# Altium schematic sheet alpakka.schdoc
size 420 x 297 mm; Symbol: Sheet-Symbol_A3; Border: 1; Title Block Position: 3; Width: 1655; Height: 1170; Region Start: 1; X Region Count: 6; Y Region Count: 4; Blade Width: 10; Title Block: 1; @Board Name: alpakka_1; @Create Time: 09:50:37; @Update Time: 01:17:22; Company: 嘉立创EDA; Version: V1.0; Page Size: A3; @Project Name: alpakka_qk; @Page Count: 1; @Update Date: 2025-06-17; @Create Date: 2025-06-03; @Schematic Name: alpakka_1; @Page No: 1; @Page Name: alpakka; Device: Sheet-Symbol_A3
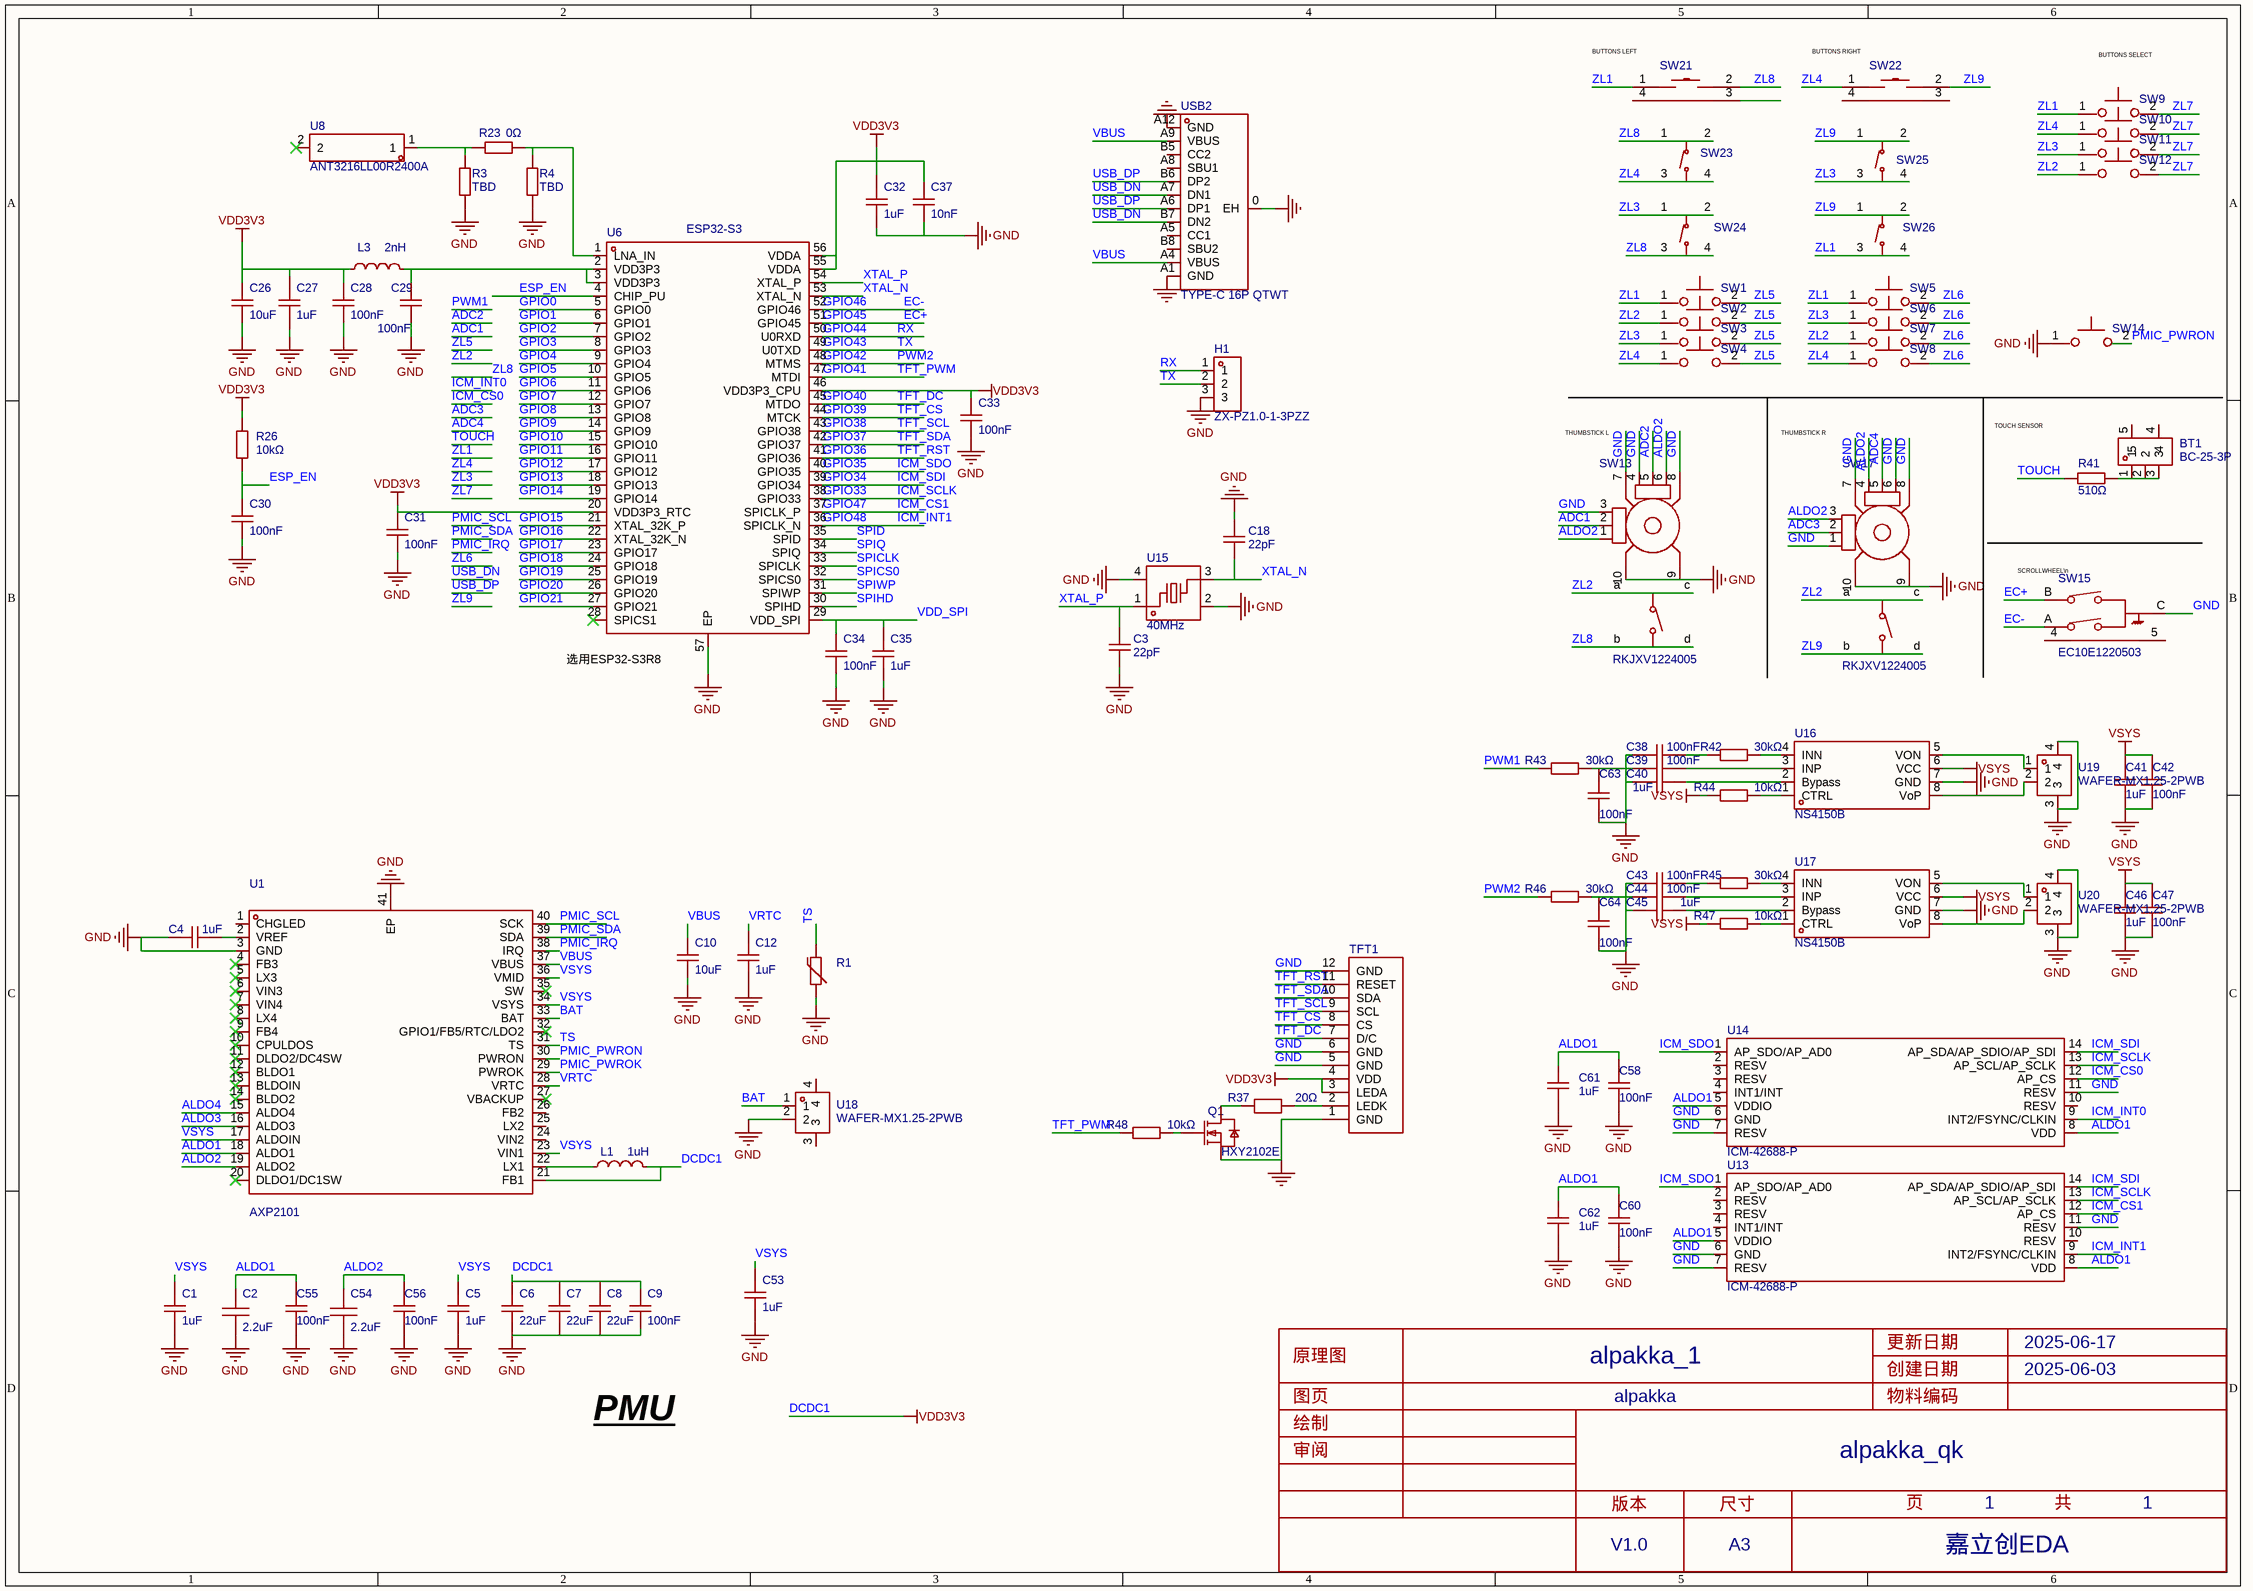
[diagram p0: alpakka.schdoc]

## Parts
BT1  BC-25-3P  [CONN-SMD_BC-25-3P]
C1  1uF  [C0402]
C2  value 2.2uF  [C0402]
C3  22pF  [C0402]
C4  1uF  [C0402]
C5  1uF  [C0402]
C6  22uF  [C0603]
C7  22uF  [C0603]
C8  22uF  [C0603]
C9  100nF  [C0402]
C10  10uF  [C0402]
C12  1uF  [C0402]
C18  22pF  [C0402]
C26  10uF  [C0402]
C27  1uF  [C0402]
C28  100nF  [C0402]
C29  100nF  [C0402]
C30  100nF  [C0402]
C31  100nF  [C0402]
C32  1uF  [C0402]
C33  100nF  [C0402]
C34  100nF  [C0402]
C35  1uF  [C0402]
C37  10nF  [C0402]
C38  100nF  [C0402]
C39  100nF  [C0402]
C40  1uF  [C0402]
C41  1uF  [C0402]
C42  100nF  [C0402]
C43  100nF  [C0402]
C44  100nF  [C0402]
C45  1uF  [C0402]
C46  1uF  [C0402]
C47  100nF  [C0402]
C53  1uF  [C0402]
C54  value 2.2uF  [C0402]
C55  100nF  [C0402]
C56  100nF  [C0402]
C58  100nF  [C0402]
C60  100nF  [C0402]
C61  1uF  [C0402]
C62  1uF  [C0402]
C63  100nF  [C0402]
C64  100nF  [C0402]
H1  ZX-PZ1.0-1-3PZZ  [HDR-TH_3P-P1.00-V-M-3]
L1  1uH  [IND-SMD_L2.5-W2.0_WPN252012H]
L3  2nH  [L0402]
Q1  HXY2102EI  [SOT-323-3_L2.1-W1.3-P1.30-LS2.3-BR]
R1  NCP18XH103F03RB  [R0603]  (value not drawn)
R3  TBD  [R0402]
R4  TBD  [R0402]
R23  0Ω  [R0402]
R26  10kΩ  [R0402]
R37  20Ω  [R0402]
R41  510Ω  [R0402]
R42  30kΩ  [R0402]
R43  30kΩ  [R0402]
R44  value 10kΩ  [R0402]  (hidden comment: 0402WGF1002TCE)
R45  30kΩ  [R0402]
R46  30kΩ  [R0402]
R47  value 10kΩ  [R0402]  (hidden comment: 0402WGF1002TCE)
R48  value 10kΩ  [R0402]  (hidden comment: 0402WGF1002TCE)
SW1  SKPMAME010  [KEY-SMD_2P-L6.0-W6.0-P6.00]  (value not drawn)
SW2  SKPMAME010  [KEY-SMD_2P-L6.0-W6.0-P6.00]  (value not drawn)
SW3  SKPMAME010  [KEY-SMD_2P-L6.0-W6.0-P6.00]  (value not drawn)
SW4  SKPMAME010  [KEY-SMD_2P-L6.0-W6.0-P6.00]  (value not drawn)
SW5  SKPMAME010  [KEY-SMD_2P-L6.0-W6.0-P6.00]  (value not drawn)
SW6  SKPMAME010  [KEY-SMD_2P-L6.0-W6.0-P6.00]  (value not drawn)
SW7  SKPMAME010  [KEY-SMD_2P-L6.0-W6.0-P6.00]  (value not drawn)
SW8  SKPMAME010  [KEY-SMD_2P-L6.0-W6.0-P6.00]  (value not drawn)
SW9  SKPMAME010  [KEY-SMD_2P-L6.0-W6.0-P6.00]  (value not drawn)
SW10  SKPMAME010  [KEY-SMD_2P-L6.0-W6.0-P6.00]  (value not drawn)
SW11  SKPMAME010  [KEY-SMD_2P-L6.0-W6.0-P6.00]  (value not drawn)
SW12  SKPMAME010  [KEY-SMD_2P-L6.0-W6.0-P6.00]  (value not drawn)
SW13  RKJXV1224005  [SW-TH_RKJXV1224005]
SW14  SKPMAME010  [KEY-SMD_2P-L6.0-W6.0-P6.00]  (value not drawn)
SW15  EC10E1220503  [SW-TH_EC10EXXXXXXX]
SW17  RKJXV1224005  [SW-TH_RKJXV1224005]
SW21  SKHHLNA010  [KEY-TH_SKHHLNA010]  (value not drawn)
SW22  SKHHLNA010  [KEY-TH_SKHHLNA010]  (value not drawn)
SW23  TS-1187A-B-A-B  [SW-SMD_4P-L5.1-W5.1-P3.70-LS6.5-TL_H1.5]  (value not drawn)
SW24  TS-1187A-B-A-B  [SW-SMD_4P-L5.1-W5.1-P3.70-LS6.5-TL_H1.5]  (value not drawn)
SW25  TS-1187A-B-A-B  [SW-SMD_4P-L5.1-W5.1-P3.70-LS6.5-TL_H1.5]  (value not drawn)
SW26  TS-1187A-B-A-B  [SW-SMD_4P-L5.1-W5.1-P3.70-LS6.5-TL_H1.5]  (value not drawn)
TFT1  tft  [0.71圆tft]  (value not drawn)
U1  (no value)  [QFN-40_L5.0-W5.0-P0.40-TL-EP3.4]
U6  ESP32-S3  [QFN-56_L7.0-W7.0-P0.40-TL-EP4.0]
U8  ANT3216LL00R2400A  [ANT-SMD_L3.2-W1.6]
U13  ICM-42688-P  [LGA-14_L3.0-W2.5-P0.50-TL]
U14  ICM-42688-P  [LGA-14_L3.0-W2.5-P0.50-TL]
U15  40MHz  [CRYSTAL-SMD_4P-L2.5-W2.0-BL]
U16  NS4150B  [MSOP-8_L3.0-W3.0-P0.65-LS5.0-BL]
U17  NS4150B  [MSOP-8_L3.0-W3.0-P0.65-LS5.0-BL]
U18  WAFER-MX1.25-2PWB  [CONN-SMD_2P-P1.25_XUNPU_WAFER-MX1.25-2PWB]
U19  WAFER-MX1.25-2PWB  [CONN-SMD_2P-P1.25_XUNPU_WAFER-MX1.25-2PWB]
U20  WAFER-MX1.25-2PWB  [CONN-SMD_2P-P1.25_XUNPU_WAFER-MX1.25-2PWB]
USB2  TYPE-C 16P QTWT  [USB-TYPE-C-SMD_TYPE-C-16P-QTWT]

## Nets
DCDC1: C6.2 C7.2 C8.2 C9.2 C26.2 C27.2 C28.2 C31.2 C32.2 C33.2 C37.2 L1.2 L3.1 R26.2 TFT1.3(LEDA) TFT1.4(VDD) U1.21(FB1) U6.20(VDD3P3_RTC) U6.46(VDD3P3_CPU) U6.55(VDDA) U6.56(VDDA)  [also labelled VDD3V3]
GND: C1.1 C2.1 C3.1 C4.1 C5.1 C6.1 C7.1 C8.1 C9.1 C10.1 C12.1 C18.2 C26.1 C27.1 C28.1 C29.1 C30.1 C31.1 C32.1 C33.1 C34.1 C35.1 C37.1 C38.1 C40.2 C41.1 C42.1 C43.1 C45.2 C46.1 C47.1 C53.1 C54.1 C55.1 C56.1 C58.1 C60.1 C61.1 C62.1 C63.1 C64.1 H1.3 Q1.2(S) R1.2 R3.1 R4.1 SW13.3(A) SW13.4(A) SW13.7(GND) SW13.8(GND) SW13.9(GND) SW13.10(GND) SW14.1 SW15.C SW17.1(B) SW17.6(B) SW17.7(GND) SW17.8(GND) SW17.9(GND) SW17.10(GND) TFT1.1(GND) TFT1.5(GND) TFT1.6(GND) TFT1.12(GND) U1.3(GND) U1.41(EP) U6.57(EP) U13.6(GND) U13.7(RESV) U13.11(RESV) U14.6(GND) U14.7(RESV) U14.11(RESV) U15.2(GND) U15.4(GND) U16.7(GND) U17.7(GND) U18.2 U19.3 U19.4 U20.3 U20.4 USB2.0(EH) USB2.A1(GND) USB2.A12(GND)
VSYS: C1.2 C5.2 C41.2 C42.2 C46.2 C47.2 C53.2 R44.1 R47.1 U1.17(ALDOIN) U1.23(VIN1) U1.34(VSYS) U1.36(VMID) U16.6(VCC) U17.6(VCC)
ADC1: SW13.2(DTA)
ADC2: SW13.5(DTA)
ADC3: SW17.2(DTA)
ADC4: SW17.5(DTA)
ALDO1: C2.2 C55.2 C58.2 C60.2 C61.2 C62.2 U1.18(ALDO1) U13.5(VDDIO) U13.8(VDD) U14.5(VDDIO) U14.8(VDD)
ALDO2: C54.2 C56.2 SW13.1(B) SW13.6(B) SW17.3(A) SW17.4(A) U1.19(ALDO2)
ALDO3: U1.16(ALDO3)
ALDO4: U1.15(ALDO4)
BAT: U1.33(BAT) U18.1
EC+: SW15.B U6.51(GPIO45)  [also labelled GPIO45]
EC-: SW15.A U6.52(GPIO46)  [also labelled GPIO46]
ESP_EN: C30.2 R26.1 U6.4(CHIP_PU)
GPIO0: U6.5(GPIO0)
GPIO1: U6.6(GPIO1)
GPIO2: U6.7(GPIO2)
GPIO3: U6.8(GPIO3)
GPIO4: U6.9(GPIO4)
GPIO5: U6.10(GPIO5)
GPIO6: U6.11(GPIO6)
GPIO7: U6.12(GPIO7)
GPIO8: U6.13(GPIO8)
GPIO9: U6.14(GPIO9)
GPIO10: U6.15(GPIO10)
GPIO11: U6.16(GPIO11)
GPIO12: U6.17(GPIO12)
GPIO13: U6.18(GPIO13)
GPIO14: U6.19(GPIO14)
GPIO15: U6.21(XTAL_32K_P)
GPIO16: U6.22(XTAL_32K_N)
GPIO17: U6.23(GPIO17)
GPIO18: U6.24(GPIO18)
GPIO19: U6.25(GPIO19)
GPIO20: U6.26(GPIO20)
GPIO21: U6.27(GPIO21)
GPIO33: U6.38(GPIO33) U13.13(AP_SCL/AP_SCLK) U14.13(AP_SCL/AP_SCLK)  [also labelled ICM_SCLK]
GPIO34: U6.39(GPIO34) U13.14(AP_SDA/AP_SDIO/AP_SDI) U14.14(AP_SDA/AP_SDIO/AP_SDI)  [also labelled ICM_SDI]
GPIO35: U6.40(GPIO35) U13.1(AP_SDO/AP_AD0) U14.1(AP_SDO/AP_AD0)  [also labelled ICM_SDO]
GPIO36: TFT1.11(RESET) U6.41(GPIO36)  [also labelled TFT_RST]
GPIO37: TFT1.10(SDA) U6.42(GPIO37)  [also labelled TFT_SDA]
GPIO38: TFT1.9(SCL) U6.43(GPIO38)  [also labelled TFT_SCL]
GPIO39: TFT1.8(CS) U6.44(MTCK)  [also labelled TFT_CS]
GPIO40: TFT1.7(D/C) U6.45(MTDO)  [also labelled TFT_DC]
GPIO41: R48.1 U6.47(MTDI)  [also labelled TFT_PWM]
GPIO42: R46.1 U6.48(MTMS)  [also labelled PWM2]
GPIO43: H1.2 U6.49(U0TXD)  [also labelled TX]
GPIO44: H1.1 U6.50(U0RXD)  [also labelled RX]
GPIO47: U6.37(SPICLK_P) U13.12(AP_CS)  [also labelled ICM_CS1]
GPIO48: U6.36(SPICLK_N) U13.9(INT2/FSYNC/CLKIN)  [also labelled ICM_INT1]
ICM_CS0: U14.12(AP_CS)
ICM_INT0: U14.9(INT2/FSYNC/CLKIN)
PMIC_IRQ: U1.38(IRQ)
PMIC_PWROK: U1.29(PWROK)
PMIC_PWRON: SW14.2 U1.30(PWRON)
PMIC_SCL: U1.40(SCK)
PMIC_SDA: U1.39(SDA)
PWM1: R43.1
SPICLK: U6.33(SPICLK)
SPICS0: U6.32(SPICS0)
SPID: U6.35(SPID)
SPIHD: U6.30(SPIHD)
SPIQ: U6.34(SPIQ)
SPIWP: U6.31(SPIWP)
TOUCH: R41.2
TS: R1.1 U1.31(TS)
USB_DN: USB2.A7(DN1) USB2.B7(DN2)
USB_DP: USB2.A6(DP1) USB2.B6(DP2)
VBUS: C10.2 U1.37(VBUS) USB2.A4(VBUS) USB2.A9(VBUS)
VDD_SPI: C34.2 C35.2 U6.29(VDD_SPI)
VRTC: C12.2 U1.28(VRTC)
XTAL_N: C18.1 U6.53(XTAL_N) U15.3
XTAL_P: C3.2 U6.54(XTAL_P) U15.1
ZL1: SW1.1 SW5.1 SW9.1 SW21.1 SW26.3(C) SW26.4(D)
ZL2: SW2.1 SW7.1 SW12.1 SW13.a SW13.c SW17.a SW17.c
ZL3: SW3.1 SW6.1 SW11.1 SW24.1(A) SW24.2(B) SW25.3(C) SW25.4(D)
ZL4: SW4.1 SW8.1 SW10.1 SW22.1 SW23.3(C) SW23.4(D)
ZL5: SW1.2 SW2.2 SW3.2 SW4.2
ZL6: SW5.2 SW6.2 SW7.2 SW8.2
ZL7: SW9.2 SW10.2 SW11.2 SW12.2
ZL8: SW13.b SW13.d SW21.2 SW23.1(A) SW23.2(B) SW24.3(C) SW24.4(D)
ZL9: SW17.b SW17.d SW22.2 SW25.1(A) SW25.2(B) SW26.1(A) SW26.2(B)
NetBT1_1: BT1.1 BT1.2 BT1.3 R41.1
NetC4_2: C4.2 U1.2(VREF)
NetC29_2: C29.2 L3.2 U6.2(VDD3P3) U6.3(VDD3P3)
NetC38_2: C38.2 R42.1
NetC39_1: C39.1 C63.2 R43.2
NetC39_2: C39.2 U16.3(INP)
NetC40_1: C40.1 U16.2(Bypass)
NetC43_2: C43.2 R45.1
NetC44_1: C44.1 C64.2 R46.2
NetC44_2: C44.2 U17.3(INP)
NetC45_1: C45.1 U17.2(Bypass)
NetL1_1: L1.1 U1.22(LX1)
NetQ1_1: Q1.1(G) R48.2
NetQ1_3: Q1.3(D) R37.1
NetR3_2: R3.2 R23.1 U8.1
NetR4_2: R4.2 R23.2 U6.1(LNA_IN)
NetR37_2: R37.2 TFT1.2(LEDK)
NetR42_2: R42.2 U16.4(INN)
NetR44_2: R44.2 U16.1(CTRL)
NetR45_2: R45.2 U17.4(INN)
NetR47_2: R47.2 U17.1(CTRL)
NetU16_5: U16.5(VON) U19.1
NetU16_8: U16.8(VoP) U19.2
NetU17_5: U17.5(VON) U20.1
NetU17_8: U17.8(VoP) U20.2

Not connected (* = marked no-connect by the designer): BT1 4 5; SW15 4 5; SW21 3 4; SW22 3 4; U1 1(CHGLED) 4(FB3)* 5(LX3)* 6(VIN3)* 7(VIN4)* 8(LX4)* 9(FB4)* 10(CPULDOS)* 11(DLDO2/DC4SW)* 12(BLDO1)* 13(BLDOIN)* 14(BLDO2)* 20(DLDO1/DC1SW)* 24(VIN2) 25(LX2) 26(FB2) 27(VBACKUP)* 32(GPIO1/FB5/RTC/LDO2)* 35(SW)*; U6 28(SPICS1)*; U8 2*; U13 2(RESV) 3(RESV) 4(INT1/INT) 10(RESV); U14 2(RESV) 3(RESV) 4(INT1/INT) 10(RESV); U18 3 4; USB2 A5(CC1) A8(SBU1) B5(CC2) B8(SBU2)

## Notes on the sheet
- (near SW21) BUTTONS LEFT
- (near SW22) BUTTONS RIGHT
- BUTTONS SELECT
- (near SW13) THUMBSTICK L
- THUMBSTICK R
- TOUCH SENSOR
- (near SW15) SCROLLWHEEL\n
- (near U6) 选用ESP32-S3R8
- PMU
- 更新日期
- 2025-06-17
- 原理图
- 图页
- alpakka_1
- alpakka
- 创建日期
- 物料编码
- 2025-06-03
- 审阅
- 绘制
- alpakka_qk
- 版本
- V1.0
- 尺寸
- A3
- 页
- 1
- 嘉立创EDA
- 共

## Library data of the parts
BT1 = BC-25-3P: Manufacturer: 韩国韩荣; AddInBom: yes; ModelId: 0ec633dd042e4116a02132133930fbed; ModelTransform: 196.85,295.275,0,0,0,0,0,0.005,0; Symbol: BC-25-3P; Device: BC-25-3P; LCSC Part Name: BC-25-3P; SupplierPart: C707322; ManufacturerPart: BC-25-3P; Supplier Footprint: SMD; JLCPCB Part Class: 扩展库; Datasheet: https://atta.szlcsc.com/upload/public/pdf/source/20200721/C707322_5998A93FC9E23FFA5808166050F8C0CF.pdf; Supplier: LCSC; ConvertToPcb: yes; FootprintName: CONN-SMD_BC-25-3P; ModelName: CONN-SMD_BC-25-3P
C1 C4 C5 C12 C27 C32 C35 C40 C41 C45 C46 C53 C61 C62 = CL05A105KA5NQNC: 容值:1uF;精度:±10%;额定电压:25V;材质(温度系数):X5R;; Manufacturer: SAMSUNG(三星); AddInBom: yes; ModelId: 36a51122f27c49738f86b3bfa98863e0; ModelName: C0402_L1.0-W0.5-H0.5; ModelTransform: 39.37,19.685,0,0,0,0,0,0,0; Tolerance: ±10%; Voltage Rated: 25V; Temperature Coefficient: X5R; Symbol: CL05A105KA5NQNC; Value: 1uF; Device: CL05A105KA5NQNC; LCSC Part Name: 1uF ±10% 25V; SupplierPart: C52923; ManufacturerPart: CL05A105KA5NQNC; Supplier Footprint: 0402; JLCPCB Part Class: 基础库; Datasheet: https://atta.szlcsc.com/upload/public/pdf/source/20160103/1457707735223.pdf; Supplier: LCSC; ConvertToPcb: yes; FootprintName: C0402
C2 C54 = CL05A225MQ5NSNC: 容值:2.2uF;精度:±20%;额定电压:6.3V;温度系数:X5R;; Manufacturer: SAMSUNG(三星); AddInBom: yes; ModelId: 36a51122f27c49738f86b3bfa98863e0; ModelName: C0402_L1.0-W0.5-H0.5; ModelTransform: 39.37,19.685,0,0,0,0,0,0,0; Tolerance: ±20%; Voltage Rated: 6.3V; Temperature Coefficient: X5R; Device: CL05A225MQ5NSNC; Symbol: CL05A225MQ5NSNC; LCSC Part Name: 2.2uF ±20% 6.3V; SupplierPart: C12530; ManufacturerPart: CL05A225MQ5NSNC; Supplier Footprint: 0402; JLCPCB Part Class: Basic Part; Datasheet: https://atta.szlcsc.com/upload/public/pdf/source/20160103/1457707666860.pdf; Supplier: LCSC; ConvertToPcb: yes; FootprintName: C0402
C3 C18 = 0402CG220J500NT: 容值:22pF;精度:±5%;额定电压:50V;温度系数:C0G;; Manufacturer: FH(风华); AddInBom: yes; ModelId: 36a51122f27c49738f86b3bfa98863e0; ModelName: C0402_L1.0-W0.5-H0.5; ModelTransform: 39.37,19.685,0,0,0,0,0,0,0; Tolerance: ±5%; Voltage Rated: 50V; Temperature Coefficient: C0G; Value: 22pF; Device: 0402CG220J500NT; Symbol: 0402CG220J500NT; LCSC Part Name: 22pF ±5% 50V; SupplierPart: C1555; ManufacturerPart: 0402CG220J500NT; Supplier Footprint: 0402; JLCPCB Part Class: 基础库; Datasheet: https://atta.szlcsc.com/upload/public/pdf/source/20170923/C1555_1506149269156988362.pdf; Supplier: LCSC; ConvertToPcb: yes; FootprintName: C0402
C6-C8 = CL10A226MQ8NRNC: 容值:22uF;精度:±20%;额定电压:6.3V;材质(温度系数):X5R;; Manufacturer: SAMSUNG(三星); AddInBom: yes; ModelId: ac125912035d415993ca9572d50418b1; ModelName: C0603_L1.6-W0.8-H0.8; ModelTransform: 62.992,31.496,0,0,0,0,0,0,0; Tolerance: ±20%; Voltage Rated: 6.3V; Temperature Coefficient: X5R; Value: 22uF; Device: CL10A226MQ8NRNC; Symbol: CL10A226MQ8NRNC; LCSC Part Name: 22uF ±20% 6.3V; SupplierPart: C59461; ManufacturerPart: CL10A226MQ8NRNC; Supplier Footprint: 0603; JLCPCB Part Class: 基础库; Datasheet: https://atta.szlcsc.com/upload/public/pdf/source/20160103/1457707740762.pdf; Supplier: LCSC; ConvertToPcb: yes; FootprintName: C0603
C9 C28-C31 C33 C34 = CL05B104KO5NNNC: 容值:100nF;精度:±10%;额定电压:16V;材质(温度系数):X7R;; Manufacturer: SAMSUNG(三星); AddInBom: yes; ModelId: 36a51122f27c49738f86b3bfa98863e0; ModelName: C0402_L1.0-W0.5-H0.5; ModelTransform: 39.37,19.685,0,0,0,0,0,0,0; Tolerance: ±10%; Voltage Rated: 16V; Temperature Coefficient: X7R; Value: 100nF; Device: CL05B104KO5NNNC; Symbol: CL05B104KO5NNNC; LCSC Part Name: 100nF ±10% 16V; SupplierPart: C1525; ManufacturerPart: CL05B104KO5NNNC; Supplier Footprint: 0402; JLCPCB Part Class: Basic Part; Datasheet: https://atta.szlcsc.com/upload/public/pdf/source/20160103/1457707674891.pdf; Supplier: LCSC; ConvertToPcb: yes; FootprintName: C0402
C10 C26 = CL05A106MQ5NUNC: 容值:10uF;精度:±20%;额定电压:6.3V;材质(温度系数):X5R;; Manufacturer: SAMSUNG(三星); AddInBom: yes; ModelId: 36a51122f27c49738f86b3bfa98863e0; ModelName: C0402_L1.0-W0.5-H0.5; ModelTransform: 39.37,19.685,0,0,0,0,0,0,0; Tolerance: ±20%; Voltage Rated: 6.3V; Temperature Coefficient: X5R; Value: 10uF; Device: CL05A106MQ5NUNC; Symbol: CL05A106MQ5NUNC; LCSC Part Name: 10uF ±20% 6.3V; SupplierPart: C15525; ManufacturerPart: CL05A106MQ5NUNC; Supplier Footprint: 0402; JLCPCB Part Class: 基础库; Datasheet: https://atta.szlcsc.com/upload/public/pdf/source/20220823/2B02EE04F8F211D38A52DCB16EB6BEBA.pdf; Supplier: LCSC; ConvertToPcb: yes; FootprintName: C0402
C37 = CL05B103KB5NNNC: 容值:10nF;精度:±10%;额定电压:50V;材质(温度系数):X7R;; Manufacturer: SAMSUNG(三星); AddInBom: yes; ModelId: 36a51122f27c49738f86b3bfa98863e0; ModelName: C0402_L1.0-W0.5-H0.5; ModelTransform: 39.37,19.685,0,0,0,0,0,0,0; Tolerance: ±10%; Voltage Rated: 50V; Temperature Coefficient: X7R; Value: 10nF; Device: CL05B103KB5NNNC; Symbol: CL05B103KB5NNNC; LCSC Part Name: 10nF ±10% 50V; SupplierPart: C15195; ManufacturerPart: CL05B103KB5NNNC; Supplier Footprint: 0402; JLCPCB Part Class: 基础库; Datasheet: https://atta.szlcsc.com/upload/public/pdf/source/20160103/1457707674468.pdf; Supplier: LCSC; ConvertToPcb: yes; FootprintName: C0402
C38 C39 C42-C44 C47 C55 C56 C58 C60 C63 C64 = CL05B104KB54PNC: 容值:100nF;精度:±10%;额定电压:50V;材质(温度系数):X7R;; Manufacturer: SAMSUNG(三星); AddInBom: yes; ModelId: 36a51122f27c49738f86b3bfa98863e0; ModelName: C0402_L1.0-W0.5-H0.5; ModelTransform: 39.37,19.685,0,0,0,0,0,0,0; Tolerance: ±10%; Voltage Rated: 50V; Temperature Coefficient: X7R; Symbol: CL05B104KB54PNC; Device: CL05B104KB54PNC; LCSC Part Name: 100nF ±10% 50V; SupplierPart: C307331; ManufacturerPart: CL05B104KB54PNC; Supplier Footprint: 0402; JLCPCB Part Class: 基础库; Datasheet: https://atta.szlcsc.com/upload/public/pdf/source/20160218/1457707763339.pdf; Supplier: LCSC; ConvertToPcb: yes; FootprintName: C0402; Value: 100nF
H1 = ZX-PZ1.0-1-3PZZ: 插针结构:1x3P;间距:1mm;行距:-;圆针/方针:方针;安装方式:直插;排数:单排;总PIN位数:3P;额定电流:750mA;配合针长度:2mm;塑高:1mm;端接针长度:2mm;触头材质:黄铜;触头镀层:金;工作温度:-40℃~+105℃;颜色:黑色;; Manufacturer: Megastar(兆星); AddInBom: yes; ModelId: 6f6203f6db8b4f489789f9ab3199bf84; ModelTransform: 118.5037,59.055,0,0,0,0,0,0,-78.74; Pin Structure: 1x3P; Pitch: 1mm; Circluar Pins/Square Pins: 方针; Current Rating: 750mA; Symbol: ZX-PZ1.0-1-3PZZ; Device: ZX-PZ1.0-1-3PZZ; LCSC Part Name: 1x3P 间距:1mm 方针 直插; SupplierPart: C37328853; ManufacturerPart: ZX-PZ1.0-1-3PZZ; Supplier Footprint: 插件,P=1mm; JLCPCB Part Class: 扩展库; Datasheet: https://atta.szlcsc.com/upload/public/pdf/source/20240812/85F48A99F7C6AED78605DAA33CDE8A90.pdf; Supplier: LCSC; ConvertToPcb: yes; FootprintName: HDR-TH_3P-P1.00-V-M-3; ModelName: HDR-TH_3P-P1.00-V-M-3; Row Spacing: -; Mounting Type: 直插; Number of Rows: 单排; Number of Pins: 3P; Length of Mating Pin: 2mm; Insulation Height: 1mm; Length of End Connection Pin: 2mm; Contact Material: 黄铜; Contact Plating: 金; Operating Temperature: -40℃~+105℃; Color: 黑色
L1 = WPN252012H1R0MT: 电感值:1uH;精度:±20%;额定电流:3A;直流电阻(DCR):54mΩ;; Manufacturer: Sunlord(顺络); AddInBom: yes; ModelId: 7ae8e774cfcf498ea5119a488d0de531; ModelName: IND-SMD_L2.5-W2.0-H1.2-252012; ModelTransform: 78.74,99.2124,0,90,0,0,0,0,0; Tolerance: ±20%; Rated Current: 3A; DC Resistance (DCR): 54mΩ; Value: 1uH; Device: WPN252012H1R0MT; Symbol: WPN252012H1R0MT; LCSC Part Name: 1uH ±20% 3A 54mΩ; SupplierPart: C98348; ManufacturerPart: WPN252012H1R0MT; Supplier Footprint: SMD; JLCPCB Part Class: 扩展库; Datasheet: https://atta.szlcsc.com/upload/public/pdf/source/20210916/5D33DED32780FEB7D0AA8BED8FC93477.pdf; Supplier: LCSC; ConvertToPcb: yes; FootprintName: IND-SMD_L2.5-W2.0_WPN252012H
L3 = LQG15HS2N0S02D: 电感值:2nH;精度:±0.3nH;额定电流:900mA;饱和电流(Isat):-;直流电阻(DCR):90mΩ;; Manufacturer: muRata(村田); AddInBom: yes; ModelId: d8d36575a3234d4790bfa765c88664a7; ModelName: L0402_L1.0-W0.5-H0.5_BEAD; ModelTransform: 39.37,19.685,0,0,0,0,0,0.0005,0; Tolerance: ±0.3nH; Rated Current: 900mA; DC Resistance (DCR): 90mΩ; Q @ Freq: 8@100MHz; Frequency - Self Resonant: 6GHz; Value: 2nH; Device: LQG15HS2N0S02D; Symbol: LQG15HS2N0S02D; LCSC Part Name: 2nH ±0.3nH 900mA 90mΩ; SupplierPart: C18216; ManufacturerPart: LQG15HS2N0S02D; Supplier Footprint: 0402; JLCPCB Part Class: 扩展库; Datasheet: https://atta.szlcsc.com/upload/public/pdf/source/20190514/C18216_4C6D770518CF7A3B206943E09D2940CE.pdf; Supplier: LCSC; ConvertToPcb: yes; FootprintName: L0402; Saturation Current (Isat): -; Ratings: -
Q1 = HXY2102EI: 类型:1个N沟道;漏源电压(Vdss):20V;连续漏极电流(Id):2A;导通电阻(RDS(on)):85mΩ@2.5V,0.3A;耗散功率(Pd):300mW;阈值电压(Vgs(th)):1V;; Manufacturer: HXY MOSFET(华轩阳电子); AddInBom: yes; ModelId: 81bbbbdf3145418d8c918b8f2fd0a837; ModelTransform: 90.551,78.74,0,0,0,0,0,0,0; Type: 1个N沟道; Drain to Source Voltage: 20V; Current - Continuous Drain(Id): 2A; Pd - Power Dissipation: 300mW; Gate Threshold Voltage (Vgs(th)@Id): 1V; Input Capacitance(Ciss@Vds): 300pF@10V; Reverse Transfer Capacitance (Crss@Vds): 80pF; Symbol: HXY2102EI; Device: HXY2102EI; LCSC Part Name: 1个N沟道 耐压:20V 电流:2A; SupplierPart: C5148642; ManufacturerPart: HXY2102EI; Supplier Footprint: SOT-323; JLCPCB Part Class: 扩展库; Datasheet: https://atta.szlcsc.com/upload/public/pdf/source/20220906/0D27EEFCD7B51BEC6BD7AC8F94EC5A10.pdf; Supplier: LCSC; ConvertToPcb: yes; FootprintName: SOT-323-3_L2.1-W1.3-P1.30-LS2.3-BR; ModelName: SOT-323-3_L2.1-W1.3-P1.30-LS2.3-BR; RDS(on): 85mΩ@2.5V,0.3A; Operating Temperature: -55℃~+150℃
R1 = NCP18XH103F03RB: 阻值(25℃):10kΩ;电阻精度:±1%;B值精度:±1%;B值(25℃/50℃):3380K;功率:100mW;最大稳态电流(25℃):310uA;B值(25℃/75℃):-;B值(25℃/85℃):3334K;B值(25℃/100℃):3455K;工作温度:-40℃~+125℃;; Manufacturer: muRata(村田); AddInBom: yes; ModelId: fc143cca1e79419f9cd78b61e9279f08; ModelTransform: 31.8897,63.7794,0,90,0,0,0,0,0; Resistance @ 25℃: 10kΩ; Resistance Tolerance: ±1%; B Constant (25℃/50℃): 3380K; Power: 100mW; Steady State Current (Max): 310uA; B Constant (25℃/85℃): 3334K; B Constant (25℃/100℃): 3455K; Device: NCP18XH103F03RB; Symbol: NCP18XH103F03RB; LCSC Part Name: 10kΩ 电阻精度:±1% 3380K; SupplierPart: C13564; ManufacturerPart: NCP18XH103F03RB; Supplier Footprint: 0603; JLCPCB Part Class: 扩展库; Datasheet: https://atta.szlcsc.com/upload/public/pdf/source/20130819/1457706638081.pdf; Supplier: LCSC; ConvertToPcb: yes; FootprintName: R0603; ModelName: R0603; B Constant Tolerance: ±1%; B Constant (25℃/75℃): -; Operating Temperature: -40℃~+125℃
R3 R4 = 0402WGF0000TCE: 电阻类型:厚膜电阻;阻值:0Ω;精度:±1%;功率:1/16W;温度系数:±800ppm/;最大工作电压:50V;工作温度范围:-55~+155;; Manufacturer: UNI-ROYAL(厚声); Check: false; AddInBom: yes; ModelId: 671aefced39d4c318694bba8bd8efd39; ModelName: R0402_L1.0-W0.5-H0.5; ModelTransform: 39.37,19.685,0,0,0,0,0,0.0005,0; Tolerance: ±1%; Power(Watts): 1/16W; Overload Voltage (Max): 50V; Value: TBD; Temperature Coefficient: ±800ppm/; Operating Temperature Range: -55~+155; Device: 0402WGF0000TCE; Symbol: 0402WGF0000TCE; LCSC Part Name: 0Ω ±1% 1/16W; SupplierPart: C17168; ManufacturerPart: 0402WGF0000TCE; Supplier Footprint: 0402; JLCPCB Part Class: 基础库; Datasheet: https://atta.szlcsc.com/upload/public/pdf/source/20200306/C422600_1E6D84923E4A46A82E41ADD87F860B5C.pdf; Supplier: LCSC; ConvertToPcb: yes; FootprintName: R0402; Type: 厚膜电阻
R23 = 0402WGF0000TCE: 电阻类型:厚膜电阻;阻值:0Ω;精度:±1%;功率:1/16W;温度系数:±800ppm/;最大工作电压:50V;工作温度范围:-55~+155;; Manufacturer: UNI-ROYAL(厚声); AddInBom: yes; ModelId: 671aefced39d4c318694bba8bd8efd39; ModelName: R0402_L1.0-W0.5-H0.5; ModelTransform: 39.37,19.685,0,0,0,0,0,0.0005,0; Tolerance: ±1%; Power(Watts): 1/16W; Overload Voltage (Max): 50V; Value: 0Ω; Temperature Coefficient: ±800ppm/; Operating Temperature Range: -55~+155; Device: 0402WGF0000TCE; Symbol: 0402WGF0000TCE; LCSC Part Name: 0Ω ±1% 1/16W; SupplierPart: C17168; ManufacturerPart: 0402WGF0000TCE; Supplier Footprint: 0402; JLCPCB Part Class: 基础库; Datasheet: https://atta.szlcsc.com/upload/public/pdf/source/20200306/C422600_1E6D84923E4A46A82E41ADD87F860B5C.pdf; Supplier: LCSC; ConvertToPcb: yes; FootprintName: R0402; Type: 厚膜电阻
R26 R44 R47 R48 = 0402WGF1002TCE: 电阻类型:厚膜电阻;阻值:10kΩ;精度:±1%;功率:62.5mW;; Manufacturer: UNI-ROYAL(厚声); AddInBom: yes; ModelId: 671aefced39d4c318694bba8bd8efd39; ModelName: R0402_L1.0-W0.5-H0.5; ModelTransform: 39.37,19.685,0,0,0,0,0,0.0005,0; Tolerance: ±1%; Power(Watts): 62.5mW; Temperature Coefficient: ±100ppm/℃; Overload Voltage (Max): 50V; Device: 0402WGF1002TCE; Symbol: 0402WGF1002TCE; LCSC Part Name: 10kΩ ±1% 62.5mW; SupplierPart: C25744; ManufacturerPart: 0402WGF1002TCE; Supplier Footprint: 0402; JLCPCB Part Class: 基础库; Datasheet: https://atta.szlcsc.com/upload/public/pdf/source/20200306/C422600_1E6D84923E4A46A82E41ADD87F860B5C.pdf; Supplier: LCSC; ConvertToPcb: yes; FootprintName: R0402; Type: 厚膜电阻; Operating Temperature Range: -55℃~+155℃
  R26: Value: 10kΩ
R37 = AF0402FR-0720RL: 电阻类型:厚膜电阻;阻值:20Ω;精度:±1%;功率:62.5mW;最大工作电压:50V;温度系数:±100ppm/℃;; Manufacturer: YAGEO(国巨); AddInBom: yes; ModelId: 98c88bc2b9094f218f3a3e30a7012738; ModelName: R0402_L1.0-W0.5-H0.4; ModelTransform: 39.37,19.685,0,0,0,0,0,0,0; Tolerance: ±1%; Power(Watts): 62.5mW; Overload Voltage (Max): 50V; Symbol: AF0402FR-0720RL; Device: AF0402FR-0720RL; LCSC Part Name: 厚膜电阻 20Ω ±1% 62.5mW; SupplierPart: C705025; ManufacturerPart: AF0402FR-0720RL; Supplier Footprint: 0402; JLCPCB Part Class: 扩展库; Datasheet: https://atta.szlcsc.com/upload/public/pdf/source/20200720/C705025_F8F68893B9797187D9694860BA30C4EB.pdf; Supplier: LCSC; ConvertToPcb: yes; FootprintName: R0402; Type: 厚膜电阻; Value: 20Ω; Temperature Coefficient: ±100ppm/℃; Operating Temperature Range: -55℃~+155℃
R41 = 0402WGF5100TCE: 电阻类型:厚膜电阻;阻值:510Ω;精度:±1%;功率:62.5mW;最大工作电压:50V;温度系数:±100ppm/℃;; Manufacturer: UNI-ROYAL(厚声); AddInBom: yes; ModelId: 98c88bc2b9094f218f3a3e30a7012738; ModelName: R0402_L1.0-W0.5-H0.4; ModelTransform: 39.37,19.685,0,0,0,0,0,0,0; Tolerance: ±1%; Power(Watts): 62.5mW; Overload Voltage (Max): 50V; Symbol: 0402WGF5100TCE; Device: 0402WGF5100TCE; LCSC Part Name: 510Ω ±1% 62.5mW 厚膜电阻; SupplierPart: C25123; ManufacturerPart: 0402WGF5100TCE; Supplier Footprint: 0402; JLCPCB Part Class: 基础库; Datasheet: https://atta.szlcsc.com/upload/public/pdf/source/20200306/C422600_1E6D84923E4A46A82E41ADD87F860B5C.pdf; Supplier: LCSC; ConvertToPcb: yes; FootprintName: R0402; Type: 厚膜电阻; Value: 510Ω; Temperature Coefficient: ±100ppm/℃; Operating Temperature Range: -55℃~+155℃
R42 R43 R45 R46 = 0402WGF3002TCE: 电阻类型:厚膜电阻;阻值:30kΩ;精度:±1%;功率:62.5mW;最大工作电压:50V;温度系数:±100ppm/℃;; Manufacturer: UNI-ROYAL(厚声); AddInBom: yes; ModelId: 98c88bc2b9094f218f3a3e30a7012738; ModelName: R0402_L1.0-W0.5-H0.4; ModelTransform: 39.37,19.685,0,0,0,0,0,0,0; Tolerance: ±1%; Power(Watts): 62.5mW; Overload Voltage (Max): 50V; Symbol: 0402WGF3002TCE; Device: 0402WGF3002TCE; LCSC Part Name: 30kΩ ±1% 62.5mW 厚膜电阻; SupplierPart: C25776; ManufacturerPart: 0402WGF3002TCE; Supplier Footprint: 0402; JLCPCB Part Class: 扩展库; Datasheet: https://atta.szlcsc.com/upload/public/pdf/source/20200306/C422600_1E6D84923E4A46A82E41ADD87F860B5C.pdf; Supplier: LCSC; ConvertToPcb: yes; FootprintName: R0402; Type: 厚膜电阻; Value: 30kΩ; Temperature Coefficient: ±100ppm/℃; Operating Temperature Range: -55℃~+155℃
SW1-SW12 SW14 = SKPMAME010: 电路结构:单刀单掷;按钮形状:圆形按钮;安装方式:立贴;开关长度:6mm;开关宽度:5.9mm;开关高度:5mm;触点电流:50mA;额定电压(DC):16V;带灯:-;机械寿命:-;; Manufacturer: ALPSALPINE(阿尔卑斯阿尔派); AddInBom: yes; ModelId: be0d10cf1ad744bda11cb4858781af3b; ModelName: KEY-SMD_2P-L6.0-W6.0-H5.0-P6.00; ModelTransform: 259.82917,236.22,0,0,0,0,0,0,0; Circuit: 单刀单掷; Actuator Style: 圆形按钮; Switch Length: 6mm; Switch Width: 5.9mm; Switch Height: 5mm; Contact Current: 50mA; Voltage Rating (DC): 16V; Symbol: SKPMAME010; Device: SKPMAME010; LCSC Part Name: 6*5.9*5mm 立贴 轻触开关; SupplierPart: C115348; ManufacturerPart: SKPMAME010; Supplier Footprint: SMD; JLCPCB Part Class: 扩展库; Datasheet: https://atta.szlcsc.com/upload/public/pdf/source/20170620/1497944811112.pdf; Supplier: LCSC; ConvertToPcb: yes; FootprintName: KEY-SMD_2P-L6.0-W6.0-P6.00; Mounting Style: 立贴; With Lamp: -; Mechanical Life: -
SW13 SW17 = RKJXV1224005: 操纵杆复位 中央按动开关 适用于航模玩具遥控器电位器、3D摇杆PS4手柄游戏机、无人机摇杆电位器、工业控制器; Manufacturer: ALPSALPINE(阿尔卑斯阿尔派); AddInBom: yes; ModelId: d71267aa208e4a128cc15a7eb8740b01; ModelTransform: 681.101,838.581,0,0,0,0,-5.905,-5.906,-86.614; Symbol: RKJXV1224005; Device: RKJXV1224005; LCSC Part Name: RKJXV1224005; SupplierPart: C146170; ManufacturerPart: RKJXV1224005; Supplier Footprint: 插件,13x13mm; JLCPCB Part Class: 扩展库; Datasheet: https://atta.szlcsc.com/upload/public/pdf/source/20180125/C146170_15168615510911301620.pdf; Supplier: LCSC; ConvertToPcb: yes; FootprintName: SW-TH_RKJXV1224005; ModelName: SW-TH_RKJXV1224005
SW15 = EC10E1220503: Manufacturer: ALPSALPINE(阿尔卑斯阿尔派); AddInBom: yes; ModelId: 0c229d12ce9545cfb4bea5dc3d5e3367; ModelName: SW-TH_EC10EXXXXXXX-L9.8-W6.1-H14.6-P2.5; ModelTransform: 434.91937,240.157,0,180,0,0,0,13.779,-137.795; Symbol: EC10E1220503; Device: EC10E1220503; LCSC Part Name: EC10E1220503; SupplierPart: C110291; ManufacturerPart: EC10E1220503; Supplier Footprint: 插件; JLCPCB Part Class: 扩展库; Datasheet: https://atta.szlcsc.com/upload/public/pdf/source/20170428/1493376811855.pdf; Supplier: LCSC; ConvertToPcb: yes; FootprintName: SW-TH_EC10EXXXXXXX
SW21 SW22 = SKHHLNA010: 电路结构:单刀单掷;按钮形状:圆形按钮;安装方式:卧插;开关长度:6.2mm;开关宽度:6.2mm;开关高度:3.85mm;触点电流:50mA;额定电压(DC):12V;带灯:-;机械寿命:-;; Manufacturer: ALPSALPINE(阿尔卑斯阿尔派); AddInBom: yes; ModelId: 1eb2d07f8e1542918240619017ae9c31; ModelName: KEY-TH_4P-L7.5-W7.9-H7.1-LS7.0-P4.5; ModelTransform: 329.04383,297.244,0,0,0,0,0,-37.402,-137.795; Circuit: 单刀单掷; Actuator Style: 圆形按钮; Switch Length: 6.2mm; Switch Height: 3.85mm; Contact Current: 50mA; Voltage Rating (DC): 12V; Symbol: SKHHLNA010; Device: SKHHLNA010; LCSC Part Name: 6.2*6.2*3.85mm 卧插 轻触开关; SupplierPart: C125031; ManufacturerPart: SKHHLNA010; Supplier Footprint: 插件; JLCPCB Part Class: 扩展库; Datasheet: https://atta.szlcsc.com/upload/public/pdf/source/20170810/C125031_1502335333955879891.pdf; Supplier: LCSC; ConvertToPcb: yes; FootprintName: KEY-TH_SKHHLNA010; Mounting Style: 卧插; Switch Width: 6.2mm; With Lamp: -; Mechanical Life: -
SW23-SW26 = TS-1187A-B-A-B: 电路结构:单刀单掷;按钮形状:圆形按钮;作用力:160gf;安装方式:立贴;开关长度:5.1mm;开关宽度:5.1mm;开关高度:1.5mm;带支架:不带;触点电流:50mA;额定电压(DC):12V;绝缘电阻:-;带灯:无;机械寿命:10万次;; Manufacturer: XKB Connectivity(中国星坤); AddInBom: yes; ModelId: 56992f66d31b474c84a0c3bd0a81f82f; ModelTransform: 255.905,204.76337,0,0,0,0,0,0,0; Circuit: 单刀单掷; Actuator Style: 圆形按钮; Operating Force: 160gf; Switch Length: 5.1mm; Switch Height: 1.5mm; Strike Gundam: 不带; Contact Current: 50mA; Voltage Rating (DC): 12V; Actuator/Cap Color: 金色; With Lamp: 无; Mechanical Life: 10万次; Symbol: TS-1187A-B-A-B; Device: TS-1187A-B-A-B; LCSC Part Name: 5.1*5.1*1.5mm 立贴 轻触开关; SupplierPart: C318884; ManufacturerPart: TS-1187A-B-A-B; Supplier Footprint: SMD; JLCPCB Part Class: 基础库; Datasheet: https://atta.szlcsc.com/upload/public/pdf/source/20200227/C318890_053E50208A88A7BA1965D8746000774E.pdf; Supplier: LCSC; ConvertToPcb: yes; FootprintName: SW-SMD_4P-L5.1-W5.1-P3.70-LS6.5-TL_H1.5; ModelName: SW-SMD_4P-L5.1-W5.1-P3.70-LS6.5-TL_H1.5; Mounting Style: 立贴; Switch Width: 5.1mm; Insulation Resistance: -; Operating Temperature: -30℃~+85℃
TFT1 = 0.71园tft: Symbol: TFT_1.28_GC9A01_CB0.8; Check: false; AddInBom: yes; Device: 0.71园tft; ConvertToPcb: yes; FootprintName: 0.71圆tft
U1 = AXP2101: Manufacturer: Allwinner(全志); Check: false; AddInBom: yes; ModelId: 49dd78c681fa4a93be92f4b2f5c46563; ModelName: QFN-40_L5.0-W5.0-H0.9-P0.4-TL-EP; ModelTransform: 196.9,196.9,0,0,0,0,0,0,0; LCSC Part Name: AXP2101; Device: AXP2101; Symbol: AXP2101; SupplierPart: C3036461; ManufacturerPart: AXP2101; Supplier Footprint: QFN-40; Datasheet: https://atta.szlcsc.comnull; Supplier: LCSC; ConvertToPcb: yes; FootprintName: QFN-40_L5.0-W5.0-P0.40-TL-EP3.4
U6 = ESP32-S3: Manufacturer: ESPRESSIF 乐鑫; Check: false; AddInBom: yes; ModelId: 105b388c0c03439aa7dbf35dd2b762a6; ModelTransform: 275.59,275.59,0,0,0,0,0,0,0; Device: ESP32-S3; Symbol: ESP32-S3; LCSC Part Name: ESP32-S3; SupplierPart: C2913192; ManufacturerPart: ESP32-S3; Supplier Footprint: QFN56(7x7); JLCPCB Part Class: 扩展库; Datasheet: https://atta.szlcsc.com/upload/public/pdf/source/20220211/8CA5C1C53CA8E3D1871752073201D38A.pdf; Supplier: LCSC; ConvertToPcb: yes; FootprintName: QFN-56_L7.0-W7.0-P0.40-TL-EP4.0; ModelName: QFN-56_L7.0-W7.0-P0.40-TL-EP4.0
U8 = ANT3216LL00R2400A: 2.4 - 2.5 GHz; Manufacturer: YAGEO(国巨); AddInBom: yes; ModelId: 7eb3a33db31f44a1a017d8a4ace7a401; ModelName: ANT-SMD_L3.2-W1.6-H1.3; ModelTransform: 126,63,0,180,0,0,0,0,0; Manufacturer Part: ANT3216LL00R2400A; Device: ANT3216LL00R2400A; Symbol: ANT3216LL00R2400A; LCSC Part Name: ANT3216LL00R2400A; SupplierPart: C293767; Supplier Footprint: 1206; JLCPCB Part Class: 扩展库; Datasheet: https://atta.szlcsc.com/upload/public/pdf/source/20181012/C293767_CDE82A2F74DC82A94DB708CB53B68F23.pdf; Supplier: LCSC; ConvertToPcb: yes; FootprintName: ANT-SMD_L3.2-W1.6
U13 U14 = ICM-42688-P: 传感器类型:加速度计陀螺仪;; Manufacturer: TDK InvenSense(应美盛); AddInBom: yes; ModelId: 776ff2ca16fe4df1a7cc54b42a3d63a3; ModelName: LGA-14_L2.5-W3.0-H0.9-P0.50; ModelTransform: 118.11,98.425,0,0,0,0,-0.005,0.0005,0; Symbol: ICM-42688-P; Device: ICM-42688-P; LCSC Part Name: ICM-42688-P; SupplierPart: C1850418; ManufacturerPart: ICM-42688-P; Supplier Footprint: LGA-14(2.5x3); JLCPCB Part Class: 扩展库; Datasheet: https://atta.szlcsc.com/upload/public/pdf/source/20210703/CF24204867ACE5B754A2B035F23E5931.pdf; Supplier: LCSC; ConvertToPcb: yes; FootprintName: LGA-14_L3.0-W2.5-P0.50-TL; Sensor Type: 加速度计陀螺仪
U15 = X252040MMB4SI: 晶振类型:贴片晶振;频率:40MHz;常温频差:±10ppm;负载电容:10pF;频率稳定度:±20ppm;; Manufacturer: YXC(扬兴晶振); AddInBom: yes; ModelId: d23e0abc26e54c15b6292fd5f43702fa; ModelTransform: 98.425,78.74,0,0,0,0,0,0,0; Normal temperature Frequency Tolerance: ±10ppm; Load Capacitance: 10pF; Frequency Stability: ±20ppm; Symbol: X252040MMB4SI; Device: X252040MMB4SI; LCSC Part Name: 40MHz ±10ppm 10pF; SupplierPart: C2885592; ManufacturerPart: X252040MMB4SI; Supplier Footprint: SMD2520-4P; JLCPCB Part Class: 扩展库; Datasheet: https://atta.szlcsc.com/upload/public/pdf/source/20240329/8B53C0AFBC5BB264DFB5D72B3757797A.pdf; Supplier: LCSC; ConvertToPcb: yes; FootprintName: CRYSTAL-SMD_4P-L2.5-W2.0-BL; ModelName: CRYSTAL-SMD_4P-L2.5-W2.0-BL; Type: 贴片晶振; Value: 40MHz; Operating Temperature: -40℃~+85℃
U16 U17 = NS4150B_C189961: 功放类型:D类功放;输出功率:3Wx1@4Ω;; Manufacturer: Nsiway(纳芯威); Symbol: NS4150; AddInBom: yes; ModelId: 1de5a054e9244f539c6db8238d445f94; ModelTransform: 118.11,196.85,0,0,0,0,0,0,0; Type of Power Amplifier: D类功放; Supply Voltage: 3V~5.25V; Device: NS4150B_C189961; LCSC Part Name: NS4150B; SupplierPart: C189961; ManufacturerPart: NS4150B; Supplier Footprint: MSOP-8; JLCPCB Part Class: 扩展库; Datasheet: https://atta.szlcsc.com/upload/public/pdf/source/20220916/DAE631F3909B9CBB38BDE76E3E6D5896.pdf; Supplier: LCSC; ConvertToPcb: yes; FootprintName: MSOP-8_L3.0-W3.0-P0.65-LS5.0-BL; ModelName: MSOP-8_L3.0-W3.0-P0.65-LS5.0-BL; Output Power: 3Wx1@4Ω
U18-U20 = WAFER-MX1.25-2PWB: 插针结构:1x2P;间距:1.25mm;安装方式:卧贴;参考系列:PicoBlade(MX 1.25);总PIN数:2P;排数:1;每排PIN数:2;行距:-;额定电流:1A;触头材质:黄铜;触头镀层:-;工作温度:-25℃~+85℃;; Manufacturer: XUNPU(讯普); AddInBom: yes; ModelId: b62b7eea20874dc98e3e9b85e15e5122; ModelTransform: 295.275,206.6925,0,0,0,0,0,-37.913,0; Pins Structure: 1x2P; Pitch: 1.25mm; Number of PINs Per Row: 2; Current Rating: 1A; Voltage Rating: 125V; Plastic Material: LCP; Supplementary Features: 辅助焊脚; Z-Height of the Board: 3.6mm; X-Length of Bottom Edge on Board (Spacing Line): 7.5mm; Y-Width of Bottom Edge on Board: 5.25mm; Symbol: WAFER-MX1.25-2PWB; Device: WAFER-MX1.25-2PWB; LCSC Part Name: 1x2P 间距:1.25mm 卧贴 系列:PicoBlade(MX 1.25); SupplierPart: C3029359; ManufacturerPart: WAFER-MX1.25-2PWB; Supplier Footprint: SMD,P=1.25mm,卧贴; JLCPCB Part Class: 扩展库; Datasheet: https://atta.szlcsc.com/upload/public/pdf/source/20220527/5ACBB683E384B6AD06743F272F933620.pdf; Supplier: LCSC; ConvertToPcb: yes; FootprintName: CONN-SMD_2P-P1.25_XUNPU_WAFER-MX1.25-2PWB; ModelName: CONN-SMD_2P-P1.25_XUNPU_WAFER-MX1.25-2PWB; Mounting Type: 卧贴; Reference Series: PicoBlade(MX 1.25); Number of Pins: 2P; Number of Rows: 1; Row Spacing: -; Contact Material: 黄铜; Contact Plating: -; Operating Temperature: -25℃~+85℃; Flame Retardant Rating: -; Color: 米色
USB2 = TYPE-C 16P QTWT: 连接器类型:Type-C;标准:USB 3.1;公母:母;安装方式:卧贴;触点数量:16P;端口数量:1;额定电流 - 电源:3A;触头材质:-;触头镀层:-;工作温度范围:-25℃~+85℃;焊接温度(最大值):-;; Manufacturer: SHOU HAN(首韩); AddInBom: yes; Gender: 母; Number of Ports: 1; Current Rating - Power (Max): 3A; Rated Voltage (Max): 5V; Connect-Disconnect Life: 1万次; Core Colour: 黑色; ModelId: 6fb0860633a147cbac38b2094b852975; ModelTransform: 446.456,299.12133,0,0,0,0,-0.002,-49.213,-27.559; Symbol: TYPE-C 16P QTWT; Device: TYPE-C 16P QTWT; LCSC Part Name: Type-C 母 卧贴; SupplierPart: C5187472; ManufacturerPart: TYPE-C 16P QTWT; Supplier Footprint: SMD; JLCPCB Part Class: 扩展库; Datasheet: https://atta.szlcsc.com/upload/public/pdf/source/20220929/9CA39B32C19F2C1116A695DA9353B6B2.pdf; Supplier: LCSC; ConvertToPcb: yes; FootprintName: USB-TYPE-C-SMD_TYPE-C-16P-QTWT; Connector Type: Type-C; Standard: USB 3.1; Mounting Style: 卧贴; Number of Contacts: 16P; Contact Material: -; Contact Plating: -; Operating Temperature Range: -25℃~+85℃; Soldering Temperature(Max): -; ModelName: USB-TYPE-C-SMD_TYPE-C-16P-QTWT